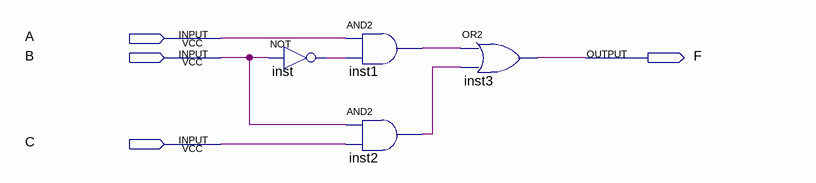
[diagram p0: schematic sheet]
// Quartus schematic Harzard2.bdf as structural Verilog: 4 symbols, 4 pins
module Harzard2 (
  input  A,
  input  B,
  input  C,
  output F
);

  wire inst1_out, inst2_out, inst_out;

  not inst (inst_out, B);
  and inst1 (inst1_out, A, inst_out);
  and inst2 (inst2_out, B, C);
  or inst3 (F, inst1_out, inst2_out);
endmodule
